# Altium schematic sheet MC_5V_3V_LDO.SchDoc: MC_5V_3V_LDO
size A4; Author: Shawn Hu; Organization: Waterloop; Address1: 200 University Ave W; Address2: Engineering 5, 1104; Address3: Waterloo, ON; Address4: N2L 3G1; Revision: Rev1; SheetNumber: 1; SheetTotal: 1
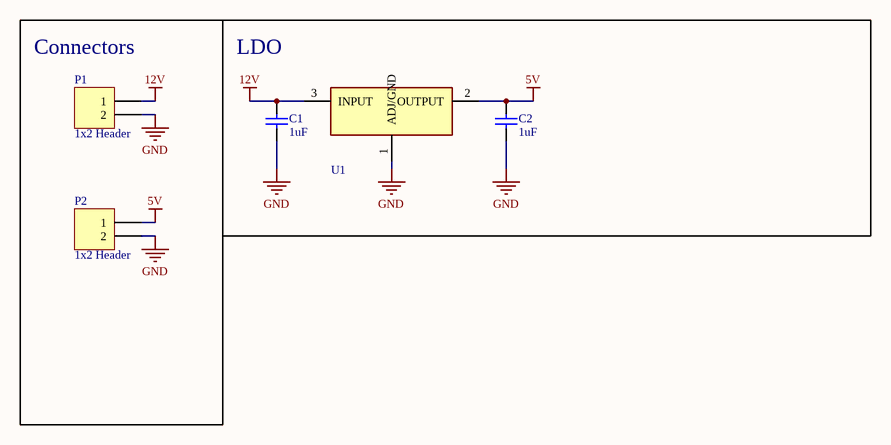
[diagram p0: MC_5V_3V_LDO.SchDoc]

## Parts
C1  value 1uF  [0805 - Capacitor]  (hidden comment: Capacitor - Nonpolarized)
C2  value 1uF  [0805 - Capacitor]  (hidden comment: Capacitor - Nonpolarized)
P1  1x2 Header  [HDR1X2]
P2  1x2 Header  [HDR1X2]
U1  TLV1117-50IDCYR  [TLV1117]  (value not drawn)

## Nets
5V: C2.2 P2.1 U1.2(OUTPUT)
12V: C1.2 P1.1 U1.3(INPUT)
GND: C1.1 C2.1 P1.2 P2.2 U1.1(ADJ/GND)

## Notes on the sheet
- (near P1) Connectors
- LDO
- Title:
- Size:
- Date:
- A4
- Author:
- Revision:
- Sheet
- of
- File:

## Library data of the parts
C1 C2 = Capacitor - Nonpolarized: Nonpolarized Capacitor; Supplier Part Number: *; Supplier: *; Manufacturer: *; Rating: *; Manufacturer Part Number: *
P1 P2 = 1x2 Header: 1x2 Pin Header
U1 = TLV1117-50IDCYR: Linear Voltage Regulator IC 5V 800MA SOT223-4; Manufacturer: Texas Instruments; Manufacturer Part Number: TLV1117-50IDCYR; Supplier Part Number: 296-21115-1-ND; Supplier: Digikey; ComponentLink1Description: Datasheet; ComponentLink1URL: http://www.ti.com/lit/ds/symlink/tlv1117.pdf?HQS=TI-null-null-digikeymode-df-pf-null-wwe&ts=1590668900314